# Altium schematic sheet sensors.SchDoc
size A
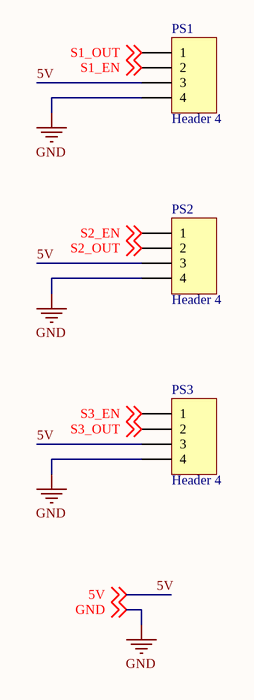
[diagram p0: sensors.SchDoc]

## Parts
PS1  Header 4  [HDR1X4]
PS2  Header 4  [HDR1X4]
PS3  Header 4  [HDR1X4]

## Nets
GND: PS1.4 PS2.4 PS3.4 ; off-sheet GND
5V: PS1.3 PS2.3 PS3.3 ; off-sheet 5V
S1_EN: PS1.2 ; off-sheet S1_EN
S1_OUT: PS1.1 ; off-sheet S1_OUT
S2_EN: PS2.1 ; off-sheet S2_EN
S2_OUT: PS2.2 ; off-sheet S2_OUT
S3_EN: PS3.1 ; off-sheet S3_EN
S3_OUT: PS3.2 ; off-sheet S3_OUT

## Library data of the parts
PS1-PS3 = Header 4: Header, 4-Pin; LatestRevisionDate: 17-Jul-2002; LatestRevisionNote: Re-released for DXP Platform.; Publisher: Altium Limited